# EAGLE design nedonand4 (EAGLE 5.12)
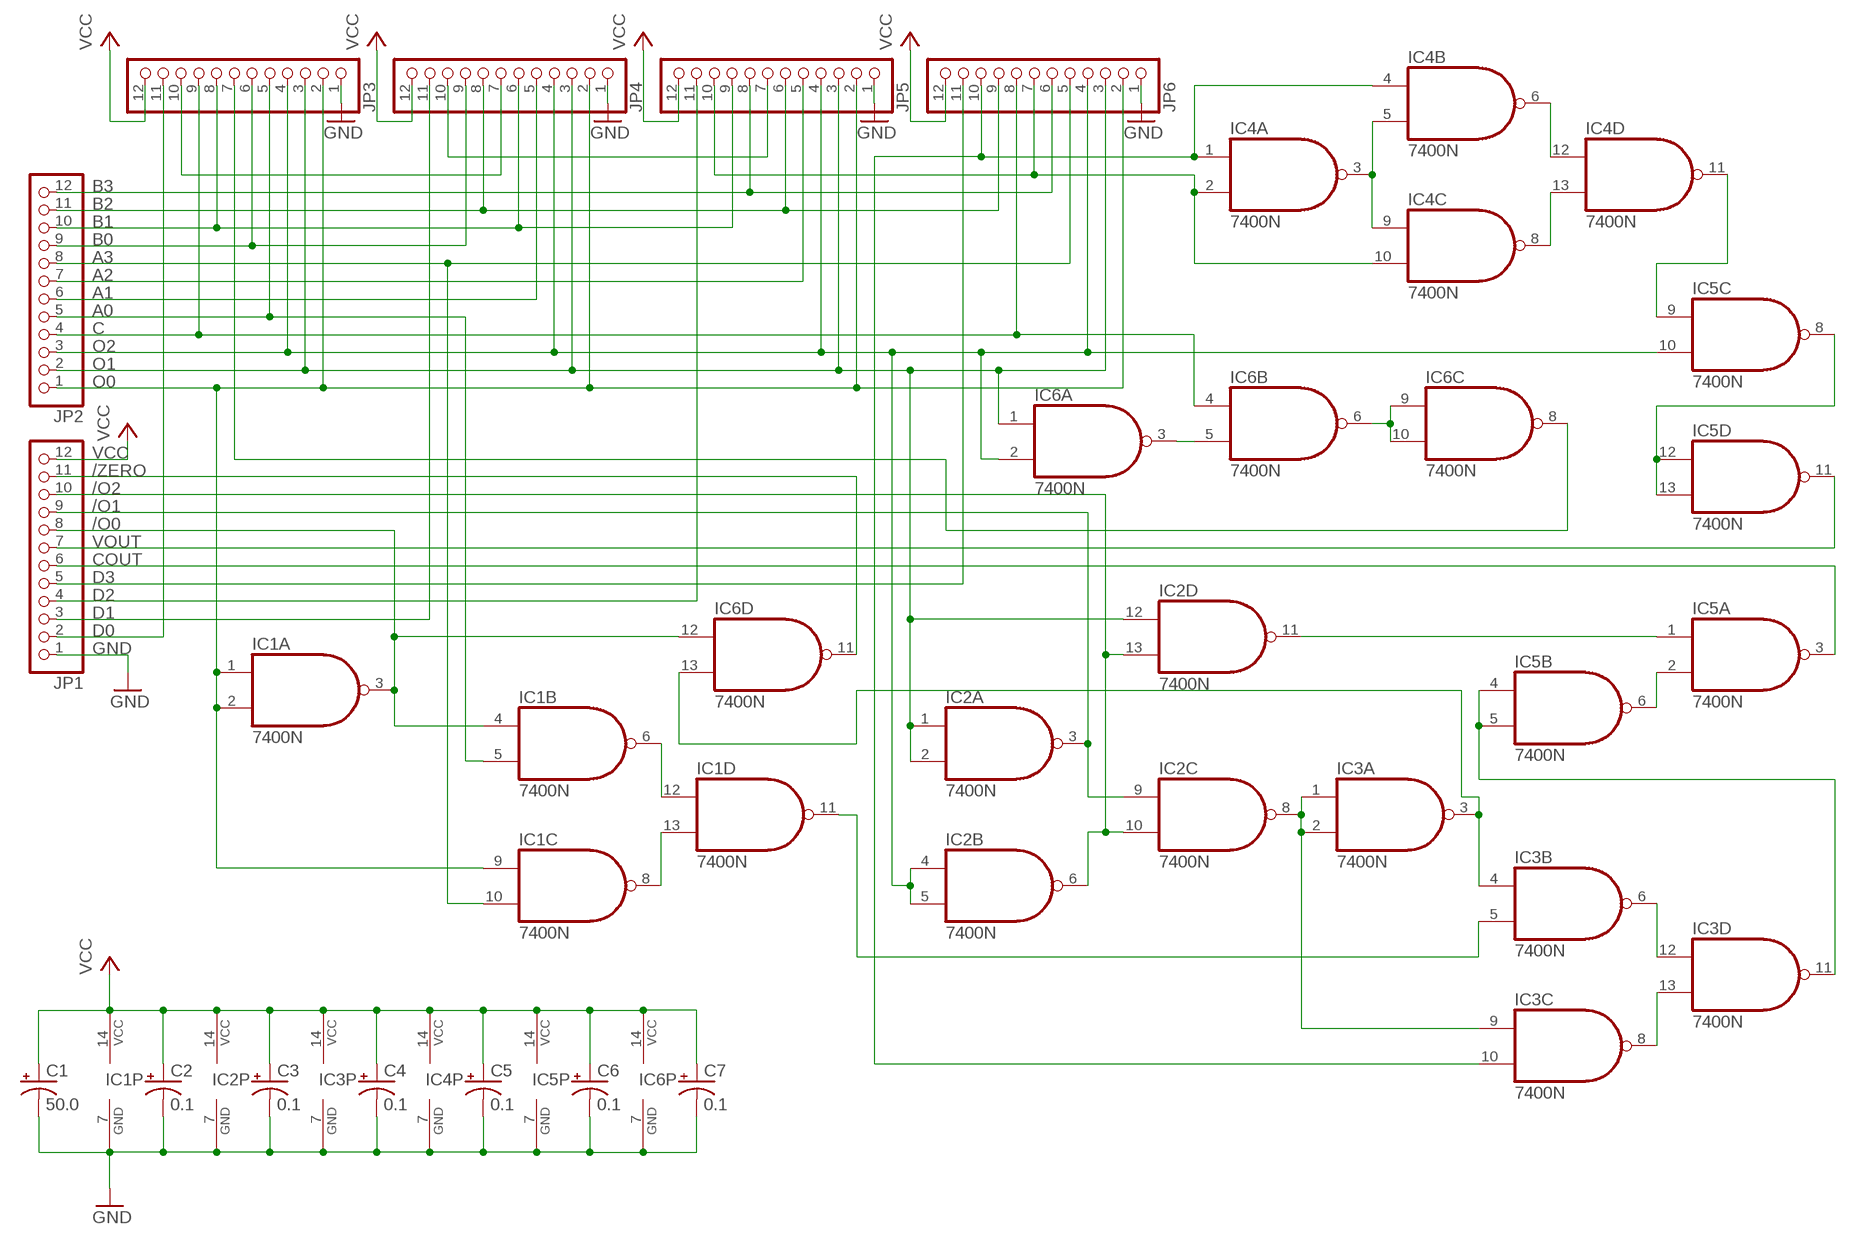
[diagram p0: schematic, sheet 1]

## Parts
C1  50.0  CPOL-USE2.5-7  [E2,5-7]
C2  0.1  CPOL-USB45181A  [B45181A]
C3  0.1  CPOL-USB45181A  [B45181A]
C4  0.1  CPOL-USB45181A  [B45181A]
C5  0.1  CPOL-USB45181A  [B45181A]
C6  0.1  CPOL-USB45181A  [B45181A]
C7  0.1  CPOL-USB45181A  [B45181A]
IC1  7400N  [DIL14]
IC2  7400N  [DIL14]
IC3  7400N  [DIL14]
IC4  7400N  [DIL14]
IC5  7400N  [DIL14]
IC6  7400N  [DIL14]
JP1  PINHD-1X12/90  [1X12/90]
JP2  PINHD-1X12/90  [1X12/90]
JP3  PINHD-1X12  [1X12]
JP4  PINHD-1X12  [1X12]
JP5  PINHD-1X12  [1X12]
JP6  PINHD-1X12  [1X12]

## Nets
/O0: IC1.3(A:O) IC1.4(B:I0) IC6.12(D:I0) JP1.8
/O1: IC2.3(A:O) IC2.9(C:I0) JP1.9
/O2: IC2.6(B:O) IC2.10(C:I1) IC2.13(D:I1) JP1.10
/ZERO: IC6.11(D:O) JP1.11
A0: IC1.5(B:I1) JP2.5 JP3.5
A1: JP2.6 JP4.5
A2: JP2.7 JP5.5
A3: IC1.10(C:I1) JP2.8 JP6.5
B0: JP2.9 JP3.6 JP4.9
B1: JP2.10 JP3.8 JP4.6 JP5.9
B2: JP2.11 JP4.8 JP5.6 JP6.9
B3: JP2.12 JP5.8 JP6.6
C: IC6.4(B:I0) JP2.4 JP3.9 JP6.8
COUT: IC5.3(A:O) JP1.6
D0: JP1.2 JP3.11
D1: JP1.3 JP4.11
D2: JP1.4 JP5.11
D3: JP1.5 JP6.11
GND: C1.- C2.- C3.- C4.- C5.- C6.- C7.- IC1.7(P:GND) IC2.7(P:GND) IC3.7(P:GND) IC4.7(P:GND) IC5.7(P:GND) IC6.7(P:GND) JP1.1 JP3.1 JP4.1 JP5.1 JP6.1
N$1: JP3.10 JP4.7
N$2: IC1.6(B:O) IC1.12(D:I0)
N$3: JP4.10 JP5.7
N$4: IC4.2(A:I1) IC4.10(C:I1) JP5.10 JP6.7
N$5: IC1.8(C:O) IC1.13(D:I1)
N$6: IC3.10(C:I1) IC4.1(A:I0) IC4.4(B:I0) JP6.10
N$7: IC4.3(A:O) IC4.5(B:I1) IC4.9(C:I0)
N$8: IC4.6(B:O) IC4.12(D:I0)
N$9: IC4.8(C:O) IC4.13(D:I1)
N$10: IC4.11(D:O) IC5.9(C:I0)
N$11: IC5.8(C:O) IC5.12(D:I0) IC5.13(D:I1)
N$12: IC2.8(C:O) IC3.1(A:I0) IC3.2(A:I1) IC3.9(C:I0)
N$14: IC1.11(D:O) IC3.5(B:I1)
N$15: IC3.6(B:O) IC3.12(D:I0)
N$16: IC3.8(C:O) IC3.13(D:I1)
N$17: IC2.11(D:O) IC5.1(A:I0)
N$18: IC3.11(D:O) IC5.4(B:I0) IC5.5(B:I1)
N$19: IC5.2(A:I1) IC5.6(B:O)
N$20: IC6.8(C:O) JP3.7
N$21: IC3.3(A:O) IC3.4(B:I0) IC6.13(D:I1)
N$22: IC6.3(A:O) IC6.5(B:I1)
N$24: IC6.6(B:O) IC6.9(C:I0) IC6.10(C:I1)
O0: IC1.1(A:I0) IC1.2(A:I1) IC1.9(C:I0) JP2.1 JP3.2 JP4.2 JP5.2 JP6.2
O1: IC2.1(A:I0) IC2.2(A:I1) IC2.12(D:I0) IC6.1(A:I0) JP2.2 JP3.3 JP4.3 JP5.3 JP6.3
O2: IC2.4(B:I0) IC2.5(B:I1) IC5.10(C:I1) IC6.2(A:I1) JP2.3 JP3.4 JP4.4 JP5.4 JP6.4
VCC: C1.+ C2.+ C3.+ C4.+ C5.+ C6.+ C7.+ IC1.14(P:VCC) IC2.14(P:VCC) IC3.14(P:VCC) IC4.14(P:VCC) IC5.14(P:VCC) IC6.14(P:VCC) JP1.12 JP3.12 JP4.12 JP5.12 JP6.12
VOUT: IC5.11(D:O) JP1.7

## Library data of the parts
C1-C7 = rcl:CPOL-US: POLARIZED CAPACITOR, American symbol
IC1-IC6 = 74xx-us:74*00: Quad 2-input NAND gate
JP1-JP6 = pinhead:PINHD-1X12: PIN HEADER

## Board
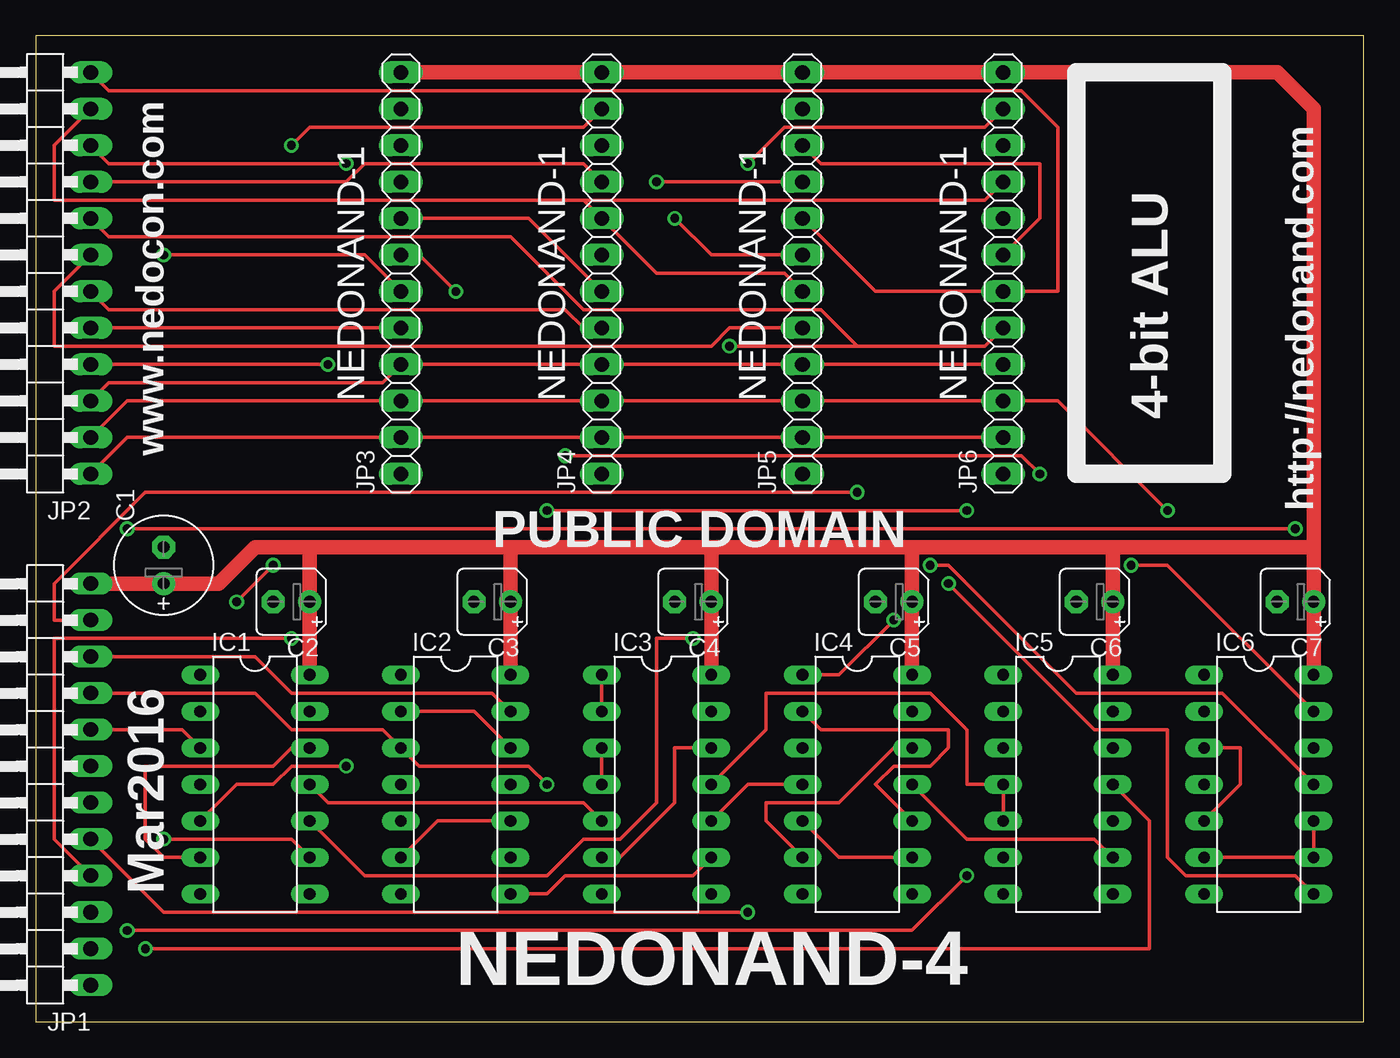
[diagram p1: board, top side]
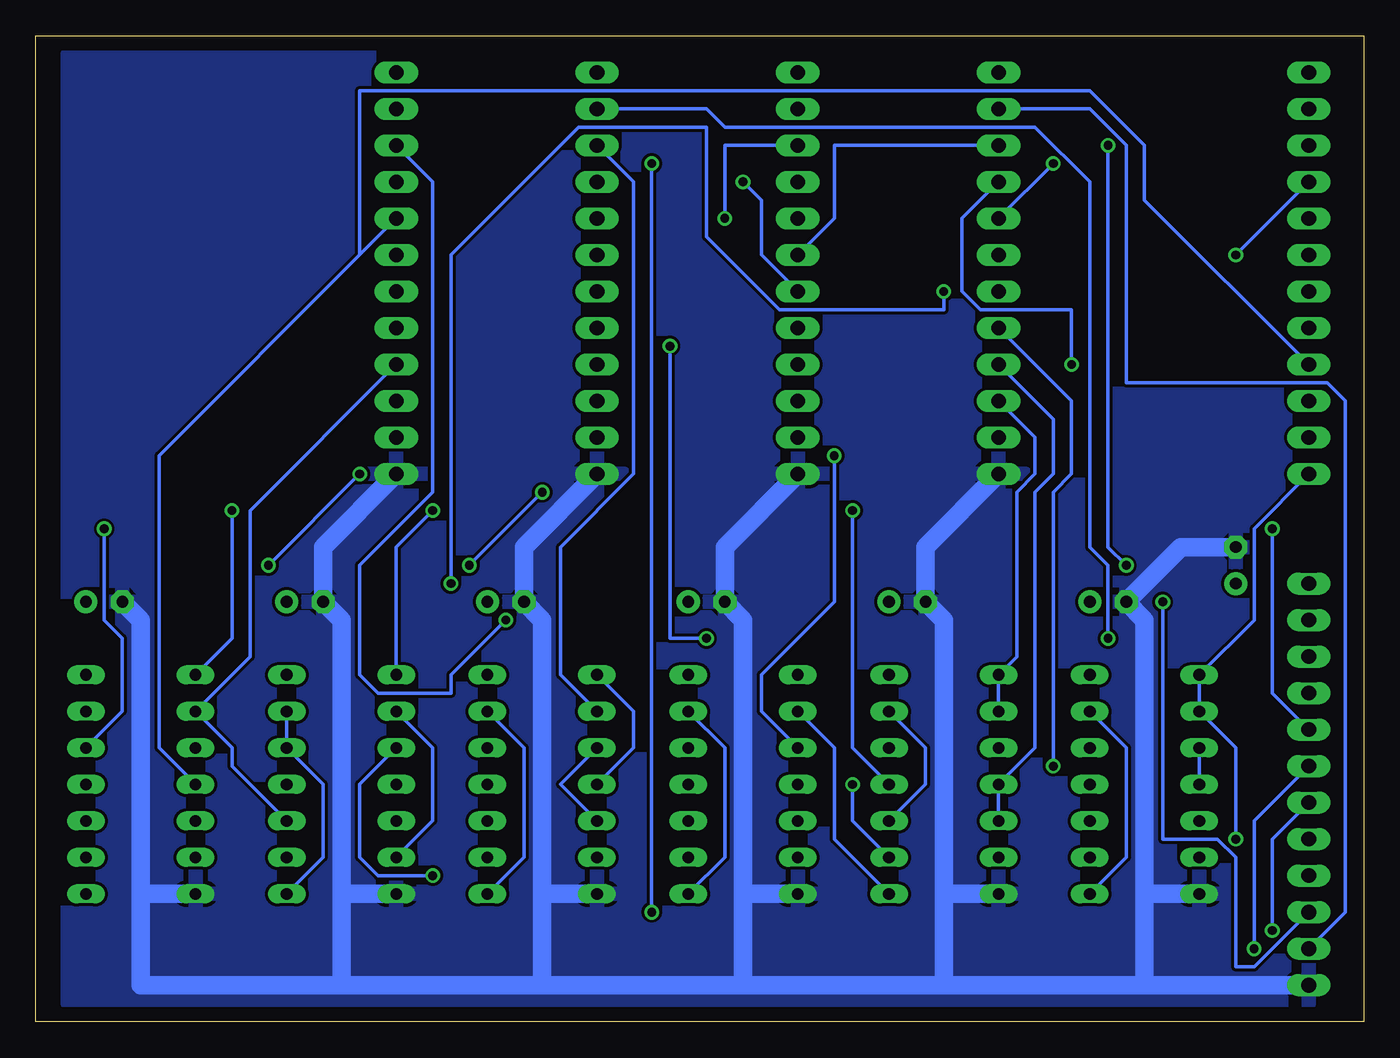
[diagram p2: board, bottom side, seen from below]

Size 92.38 x 68.57 mm. Coordinates in mm from the lower left corner, seen from the top.
Outline: 0,0 92.38,0 92.38,68.57 0,68.57 0,0
Copper layers (1*16): Top 0.035mm / dielectric 1.5mm / Bottom 0.035mm
Design rules "default": minimum track width 10mil, minimum drill 24mil, track to track 8mil, track to pad 8mil, pad to pad 8mil, via to via 8mil, smd to smd 8mil, copper to edge 40mil, drill to drill 8mil, minimum pad ring 10mil, minimum via ring 8mil, stop-mask expansion 4mil, vias tented up to drill 0mil, thermal gap 10mil

### Footprints (pad centres in the part's own frame; a part is rotated, then mirrored left to right if it is on the bottom)
E2,5-7 = drill 0.813 pad 1.6 round: + -1.27,0 | drill 0.813 pad 1.6 octagon: - 1.27,0
B45181A = drill 0.813 pad 1.6 round: + -1.27,0 | drill 0.813 pad 1.6 octagon: - 1.27,0
DIL14 = drill 0.813 long: 1 -7.62,-3.81; 2 -5.08,-3.81; 3 -2.54,-3.81; 4 0,-3.81; 5 2.54,-3.81; 6 5.08,-3.81; 7 7.62,-3.81; 8 7.62,3.81; 9 5.08,3.81; 10 2.54,3.81; 11 0,3.81; 12 -2.54,3.81; 13 -5.08,3.81; 14 -7.62,3.81
1X12/90 = drill 1.016 long: 1 -13.97,-3.81; 2 -11.43,-3.81; 3 -8.89,-3.81; 4 -6.35,-3.81; 5 -3.81,-3.81; 6 -1.27,-3.81; 7 1.27,-3.81; 8 3.81,-3.81; 9 6.35,-3.81; 10 8.89,-3.81; 11 11.43,-3.81; 12 13.97,-3.81
1X12 = drill 1.016 long: 1 -13.97,0; 2 -11.43,0; 3 -8.89,0; 4 -6.35,0; 5 -3.81,0; 6 -1.27,0; 7 1.27,0; 8 3.81,0; 9 6.35,0; 10 8.89,0; 11 11.43,0; 12 13.97,0

### Placement (x,y rotation side)
C1  8.89,31.75 90 top
C2  17.78,29.21 180 top
C3  31.75,29.21 180 top
C4  45.72,29.21 180 top
C5  59.69,29.21 180 top
C6  73.66,29.21 180 top
C7  87.63,29.21 180 top
IC1  15.24,16.51 270 top
IC2  29.21,16.51 270 top
IC3  43.18,16.51 270 top
IC4  57.15,16.51 270 top
IC5  71.12,16.51 270 top
IC6  85.09,16.51 270 top
JP1  0,16.51 90 top
JP2  0,52.07 90 top
JP3  25.4,52.07 90 top
JP4  39.37,52.07 90 top
JP5  53.34,52.07 90 top
JP6  67.31,52.07 90 top

### Tracks (layer width: path | path; a pad name or v marks a point on that pad's centre or on a via)
/O0  (via drill 0.61)
  Top 0.254: v6.35,34.29 v87.63,34.29 | IC1.3 10.16,20.32 JP1.8
  Bottom 0.254: IC1.3 IC1.4 | IC6.12 86.36,21.59 86.36,26.67 87.63,27.94 v87.63,34.29 | v6.35,34.29 6.35,22.86 JP1.8
/O1  (via drill 0.61)
  Top 0.254: v35.56,16.51 34.29,17.78 26.67,17.78 IC2.3 24.13,20.32 17.78,20.32 15.24,22.86 JP1.9
  Bottom 0.254: IC2.9 35.56,13.97 v35.56,16.51
/O2
  Top 0.254: IC2.6 27.94,13.97 IC2.10 | JP1.10 15.24,25.4 17.78,22.86 31.75,22.86 IC2.13
  Bottom 0.254: IC2.13 30.48,19.05 30.48,16.51 IC2.10
/ZERO  (via drill 0.61)
  Top 0.254: IC6.11 82.55,22.86 72.39,22.86 63.5,31.75 v62.23,31.75 | v57.15,36.83 7.62,36.83 1.27,30.48 1.27,27.94 JP1.11
  Bottom 0.254: v57.15,36.83 v62.23,31.75
A0  (via drill 0.61)
  Top 0.254: IC1.5 13.97,16.51 16.51,16.51 17.78,17.78 v21.59,17.78 | JP3.5 JP2.5
  Bottom 0.254: v21.59,17.78 21.59,36.83 20.32,38.1 20.32,43.18 JP3.5
A1
  Top 0.254: JP2.6 5.08,49.53 36.83,49.53 38.1,48.26 JP4.5
A2
  Top 0.254: JP2.7 1.27,50.8 1.27,46.99 46.99,46.99 48.26,48.26 JP5.5
A3  (via drill 0.61)
  Top 0.254: IC1.10 22.86,10.16 35.56,10.16 38.1,12.7 40.64,12.7 43.18,15.24 43.18,26.67 v45.72,26.67 | 57.15,46.99 66.04,46.99 JP6.5 | v48.26,46.99 57.15,46.99 | JP2.8 5.08,54.61 33.02,54.61 38.1,49.53 54.61,49.53 57.15,46.99
  Bottom 0.254: v45.72,26.67 48.26,26.67 v48.26,46.99
B0  (via drill 0.61)
  Top 0.254: JP3.6 22.86,53.34 v8.89,53.34 | JP4.9 38.1,59.69 22.86,59.69 21.59,58.42 JP2.9
  Bottom 0.254: JP2.9 v8.89,53.34
B1  (via drill 0.61)
  Top 0.254: JP2.10 5.08,59.69 v21.59,59.69 | JP4.6 34.29,55.88 JP3.8 | v43.18,58.42 JP5.9
  Bottom 0.254: v21.59,59.69 JP3.8 | v43.18,58.42 41.91,57.15 41.91,53.34 JP4.6
B2
  Top 0.254: JP2.11 1.27,60.96 1.27,57.15 38.1,57.15 | 38.1,57.15 JP4.8 43.18,52.07 52.07,52.07 JP5.6 | JP6.9 66.04,57.15 38.1,57.15
B3
  Top 0.254: JP2.12 5.08,64.77 68.58,64.77 71.12,62.23 71.12,50.8 JP6.6 58.42,50.8 JP5.8
C  (via drill 0.61)
  Top 0.254: JP2.4 v20.32,45.72
  Bottom 0.254: IC6.4 83.82,19.05 83.82,39.37 69.85,53.34 | 69.85,53.34 JP6.8 | JP2.4 15.24,57.15 15.24,60.96 19.05,64.77 69.85,64.77 69.85,53.34 | JP3.9 27.94,55.88 27.94,50.8 26.67,49.53 20.32,49.53 v20.32,45.72
COUT  (via drill 0.61)
  Top 0.254: v64.77,10.16 60.96,6.35 v6.35,6.35
  Bottom 0.254: IC5.3 69.85,16.51 69.85,11.43 68.58,10.16 v64.77,10.16 | v6.35,6.35 6.35,12.7 JP1.6
D0
  Bottom 0.254: JP1.2 1.27,7.62 1.27,43.18 2.54,44.45 16.51,44.45 16.51,60.96 19.05,63.5 JP3.11
D1  (via drill 0.61)
  Top 0.254: v13.97,29.21 v16.51,31.75 | v17.78,60.96 19.05,62.23 38.1,62.23 JP4.11
  Bottom 0.254: JP1.3 7.62,3.81 8.89,3.81 8.89,11.43 10.16,12.7 13.97,12.7 v13.97,29.21 | v16.51,31.75 17.78,33.02 v17.78,60.96
D2  (via drill 0.61)
  Top 0.254: JP1.4 1.27,12.7 1.27,26.67 v17.78,26.67
  Bottom 0.254: v17.78,26.67 17.78,31.75 19.05,33.02 19.05,58.42 22.86,62.23 44.45,62.23 45.72,63.5 JP5.11
D3  (via drill 0.61)
  Top 0.254: JP1.5 8.89,7.62 v49.53,7.62 | v49.53,59.69 52.07,62.23 66.04,62.23 JP6.11
  Bottom 0.254: v49.53,7.62 v49.53,59.69
GND
  Bottom 1.27: JP1.1 15.24,2.54 | 15.24,2.54 29.21,2.54 | 29.21,2.54 43.18,2.54 | 43.18,2.54 57.15,2.54 | 57.15,2.54 71.12,2.54 | 71.12,2.54 85.09,2.54 85.09,8.89 | 85.09,8.89 85.09,27.94 C7.- | 71.12,2.54 71.12,8.89 | 71.12,8.89 71.12,27.94 C6.- 72.39,33.02 JP6.1 | 85.09,8.89 IC6.7 | 71.12,8.89 IC5.7 | 57.15,2.54 57.15,8.89 | 57.15,8.89 57.15,27.94 C5.- 58.42,33.02 JP5.1 | 43.18,2.54 43.18,8.89 | 43.18,8.89 43.18,27.94 C4.- 44.45,33.02 JP4.1 | 29.21,2.54 29.21,8.89 | 29.21,8.89 29.21,27.94 C3.- 30.48,33.02 JP3.1 | 15.24,2.54 15.24,8.89 | 15.24,8.89 15.24,27.94 C2.- 12.7,33.02 C1.- | 15.24,8.89 IC1.7 | 29.21,8.89 IC2.7 | 43.18,8.89 IC3.7 | 57.15,8.89 IC4.7
  pour Bottom: 3.81,1.27 3.81,67.31 90.17,67.31 90.17,1.27
N$1
  Bottom 0.254: JP3.10 36.83,60.96 36.83,55.88 JP4.7
N$2
  Top 0.254: IC1.6 8.89,11.43 7.62,12.7 7.62,17.78 16.51,17.78 17.78,19.05 IC1.12
N$3  (via drill 0.61)
  Top 0.254: v44.45,55.88 46.99,53.34 JP5.7
  Bottom 0.254: JP4.10 44.45,60.96 v44.45,55.88
N$4
  Top 0.254: IC4.10 58.42,16.51 59.69,17.78 62.23,17.78 63.5,19.05 63.5,20.32 54.61,20.32 IC4.2 | JP6.7 69.85,55.88 69.85,59.69 54.61,59.69 JP5.10
  Bottom 0.254: IC4.2 55.88,24.13 55.88,33.02 50.8,38.1 50.8,58.42 JP5.10
N$5
  Bottom 0.254: IC1.8 16.51,11.43 16.51,19.05 IC1.13
N$6  (via drill 0.61)
  Top 0.254: IC3.10 49.53,16.51 IC4.4 | v59.69,27.94 55.88,24.13 IC4.1
  Bottom 0.254: IC4.1 50.8,21.59 50.8,19.05 IC4.4 | JP6.10 64.77,58.42 64.77,36.83 69.85,31.75 69.85,24.13 68.58,22.86 63.5,22.86 63.5,24.13 v59.69,27.94
N$7
  Top 0.254: IC4.5 55.88,11.43 IC4.9
  Bottom 0.254: IC4.3 55.88,16.51 IC4.5
N$8
  Top 0.254: IC4.6 50.8,13.97 50.8,15.24 55.88,15.24 59.69,19.05 IC4.12
N$9
  Bottom 0.254: IC4.8 58.42,11.43 58.42,19.05 IC4.13
N$10
  Top 0.254: IC4.11 64.77,12.7 73.66,12.7 IC5.9
N$11
  Bottom 0.254: IC5.8 72.39,11.43 72.39,16.51 IC5.12 IC5.13
N$12
  Top 0.254: IC3.2 IC3.1 | IC3.9 45.72,10.16 36.83,10.16 35.56,8.89 IC2.8
  Bottom 0.254: IC2.8 36.83,12.7 36.83,19.05 IC3.2
N$14
  Top 0.254: IC1.11 20.32,15.24 38.1,15.24 IC3.5
N$15
  Top 0.254: IC3.6 40.64,11.43 44.45,15.24 44.45,19.05 IC3.12
N$16
  Bottom 0.254: IC3.8 44.45,11.43 44.45,19.05 IC3.13
N$17  (via drill 0.61)
  Top 0.254: v35.56,35.56 v64.77,35.56
  Bottom 0.254: IC2.11 35.56,19.05 v35.56,35.56 | v64.77,35.56 67.31,33.02 IC5.1
N$18
  Top 0.254: IC3.11 50.8,20.32 50.8,22.86 62.23,22.86 64.77,20.32 64.77,16.51 IC5.4 IC5.5
N$19
  Bottom 0.254: IC5.6 64.77,13.97 64.77,19.05 IC5.2
N$20  (via drill 0.61)
  Top 0.254: IC6.8 87.63,10.16 80.01,10.16 78.74,11.43 78.74,20.32 73.66,20.32 v63.5,30.48 | v29.21,50.8 26.67,53.34 JP3.7
  Bottom 0.254: v63.5,30.48 63.5,53.34 54.61,62.23 45.72,62.23 45.72,54.61 40.64,49.53 29.21,49.53 v29.21,50.8
N$21  (via drill 0.61)
  Top 0.254: IC3.4 IC3.3 | IC6.13 78.74,31.75 v76.2,31.75 | v69.85,38.1 68.58,39.37 v36.83,39.37
  Bottom 0.254: v69.85,38.1 v76.2,31.75 | v36.83,39.37 36.83,29.21 41.91,24.13 41.91,21.59 IC3.3
N$22
  Top 0.254: IC6.5 83.82,16.51 83.82,19.05 IC6.3
N$24
  Top 0.254: IC6.6 IC6.9 IC6.10
O0  (via drill 0.61)
  Top 0.254: IC1.9 17.78,12.7 v8.89,12.7 | JP2.1 6.35,40.64 JP3.2 JP4.2 JP5.2 JP6.2
  Bottom 0.254: v8.89,12.7 8.89,19.05 IC1.2 IC1.1 7.62,27.94 7.62,34.29 JP2.1
O1  (via drill 0.61)
  Top 0.254: v78.74,35.56 71.12,43.18 JP6.3 JP5.3 JP4.3 JP3.3 6.35,43.18 JP2.2 | IC2.12 30.48,21.59 IC2.2
  Bottom 0.254: IC6.1 78.74,26.67 v78.74,35.56 | IC2.2 IC2.1 24.13,25.4 24.13,36.83 22.86,38.1 22.86,40.64 JP3.3
O2
  Top 0.254: JP2.3 5.08,44.45 24.13,44.45 JP3.4 JP4.4 JP5.4 JP6.4
  Bottom 0.254: IC5.10 78.74,17.78 78.74,19.05 IC6.2 77.47,25.4 77.47,35.56 JP6.4 | IC2.5 IC2.4 22.86,19.05 22.86,36.83 21.59,38.1 21.59,41.91 JP3.4
VCC
  Top 1.016: JP1.12 C1.+ 12.7,30.48 15.24,33.02 19.05,33.02 | 19.05,33.02 33.02,33.02 | 33.02,33.02 46.99,33.02 | 46.99,33.02 60.96,33.02 | 60.96,33.02 74.93,33.02 | 74.93,33.02 88.9,33.02 | 88.9,33.02 C7.+ IC6.14 | IC5.14 C6.+ 74.93,33.02 | IC4.14 C5.+ 60.96,33.02 | IC3.14 C4.+ 46.99,33.02 | IC2.14 C3.+ 33.02,33.02 | IC1.14 C2.+ 19.05,33.02 | JP3.12 JP4.12 JP5.12 JP6.12 86.36,66.04 88.9,63.5 88.9,33.02
VOUT  (via drill 0.61)
  Top 0.254: IC5.11 77.47,13.97 77.47,5.08 v7.62,5.08
  Bottom 0.254: v7.62,5.08 7.62,13.97 JP1.7

### Text on the board
tNames: NEDONAND-1 | NEDONAND-1 | NEDONAND-1 | NEDONAND-1 | 4-bit ALU | www.nedocon.com | http://nedonand.com | PUBLIC DOMAIN | Mar2016 | NEDONAND-4